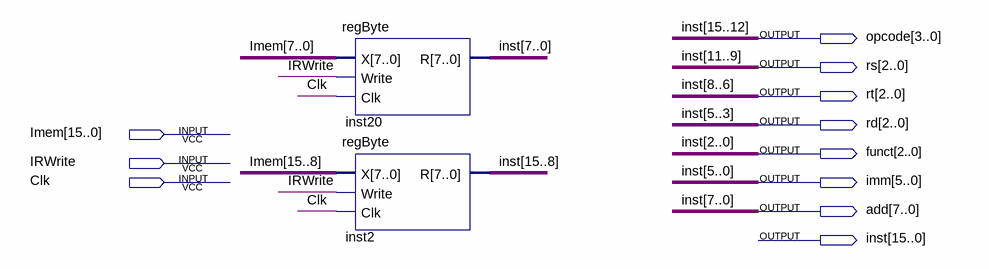
[diagram p0: schematic sheet]
// Quartus schematic instReg.bdf as structural Verilog: 2 symbols, 11 pins
module instReg (
  input  [15:0] Imem,
  input  IRWrite,
  input  Clk,
  output [3:0] opcode,
  output [2:0] rs,
  output [2:0] rt,
  output [2:0] rd,
  output [2:0] funct,
  output [5:0] imm,
  output [7:0] add,
  output [15:0] inst
);

  regByte inst20 (.X(Imem[7:0]), .Write(IRWrite), .Clk(Clk), .R(add));
  regByte inst2 (.X(Imem[15:8]), .Write(IRWrite), .Clk(Clk), .R(inst[15:8]));

  assign funct = add[2:0];
  assign imm = add[5:0];
  assign inst[7:0] = add;
  assign opcode = inst[15:12];
  assign rd = add[5:3];
  assign rs = inst[11:9];
  assign rt = {inst[8], add[7:6]};
endmodule
